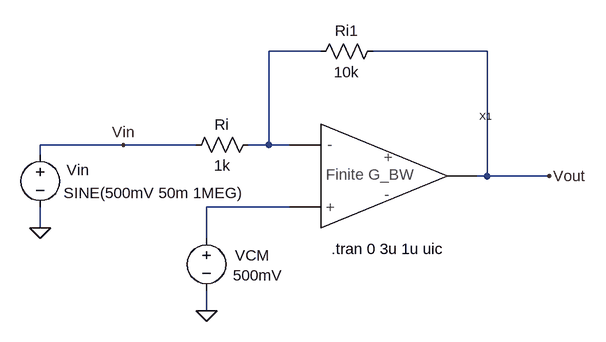
[diagram p0: schematic FiniteGBW_op_amp_x10.asc]
FiniteGBW_op_amp_x10.asc, the LTspice schematic file:
Version 4
SHEET 1 2760 680
WIRE 480 -160 480 -176
WIRE 480 -48 480 -80
WIRE 608 -176 480 -176
WIRE 720 -176 608 -176
WIRE 736 -32 736 -80
WIRE 736 80 736 48
WIRE 832 -176 800 -176
WIRE 832 -176 832 -320
WIRE 864 -176 832 -176
WIRE 864 -80 736 -80
WIRE 912 -320 832 -320
WIRE 1168 -320 992 -320
WIRE 1168 -128 1152 -128
WIRE 1168 -128 1168 -320
WIRE 1264 -128 1168 -128
FLAG 1264 -128 Vout
FLAG 736 80 0
FLAG 480 -48 0
FLAG 608 -176 Vin
SYMBOL res 704 -160 R270
WINDOW 0 32 56 VTop 0
WINDOW 3 0 56 VBottom 0
SYMATTR InstName Ri
SYMATTR Value 1k
SYMBOL res 896 -304 R270
WINDOW 0 32 56 VTop 0
WINDOW 3 0 56 VBottom 0
SYMATTR InstName Ri1
SYMATTR Value 10k
SYMBOL voltage 736 -48 R0
WINDOW 0 44 42 Left 0
WINDOW 3 41 73 Left 0
SYMATTR InstName VCM
SYMATTR Value 500mV
SYMBOL voltage 480 -176 R0
WINDOW 0 41 39 Left 0
WINDOW 3 36 74 Left 0
WINDOW 123 0 0 Left 0
WINDOW 39 0 0 Left 0
SYMATTR InstName Vin
SYMATTR Value SINE(500mV 50m 1MEG)
SYMBOL Gain_BW_op_amp 912 -128 R0
SYMATTR InstName X1
TEXT 928 -16 Left 0 !.tran 0 3u 1u uic

The netlist it stands for:
* FiniteGBW_op_amp_x10.asc
Ri Vin N002 1k
Ri1 N002 Vout 10k
VCM N001 0 500mV
Vin Vin 0 SINE(500mV 50m 1MEG)
XX1 N002 N001 Vout Gain_BW_op_amp  ; pins Vinm Vinp Out
.tran 0 3u 1u uic
.backanno
.end